# Altium project Project-C_VOLTAGE.PrjPCB (part 2 of 6)

## Sheet VoltageAmplifier_1xFPGA.SchDoc
size 635 x 241 mm
Used 4 times, as channels U_VoltageAmplifier_1xFPGA1, U_VoltageAmplifier_1xFPGA2, U_VoltageAmplifier_1xFPGA3, U_VoltageAmplifier_1xFPGA4. Parts and nets are listed once, with the designators drawn on the sheet.
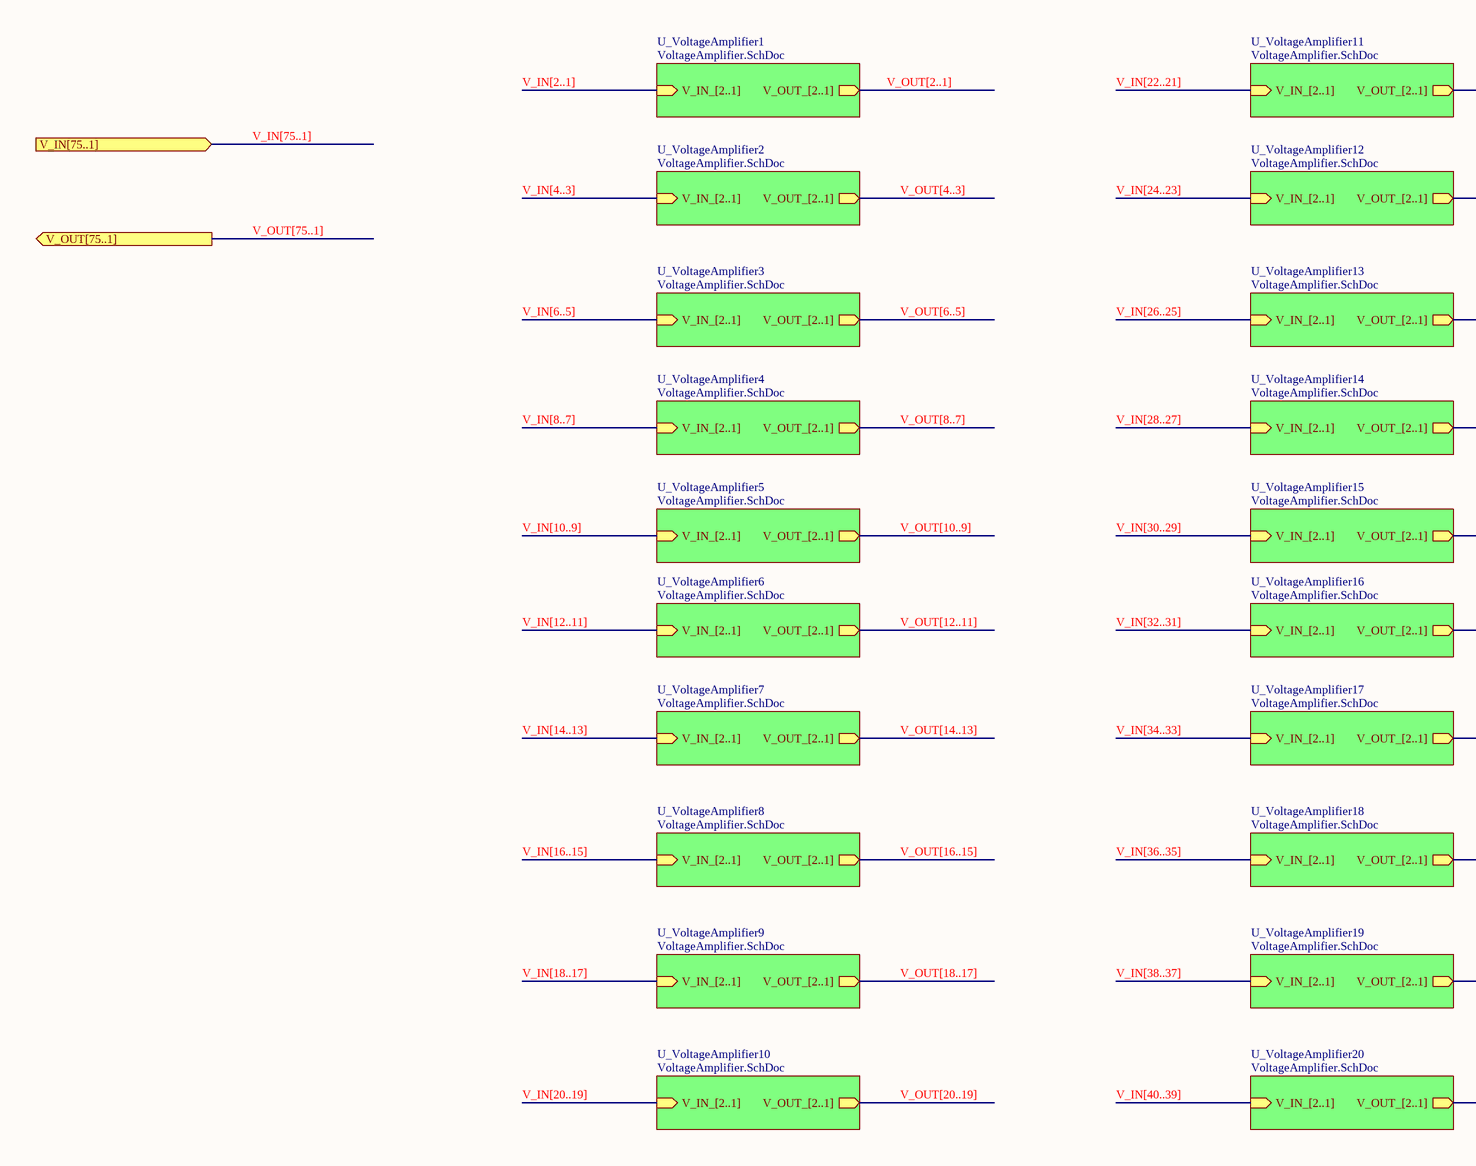
[diagram p7: VoltageAmplifier_1xFPGA.SchDoc, left]
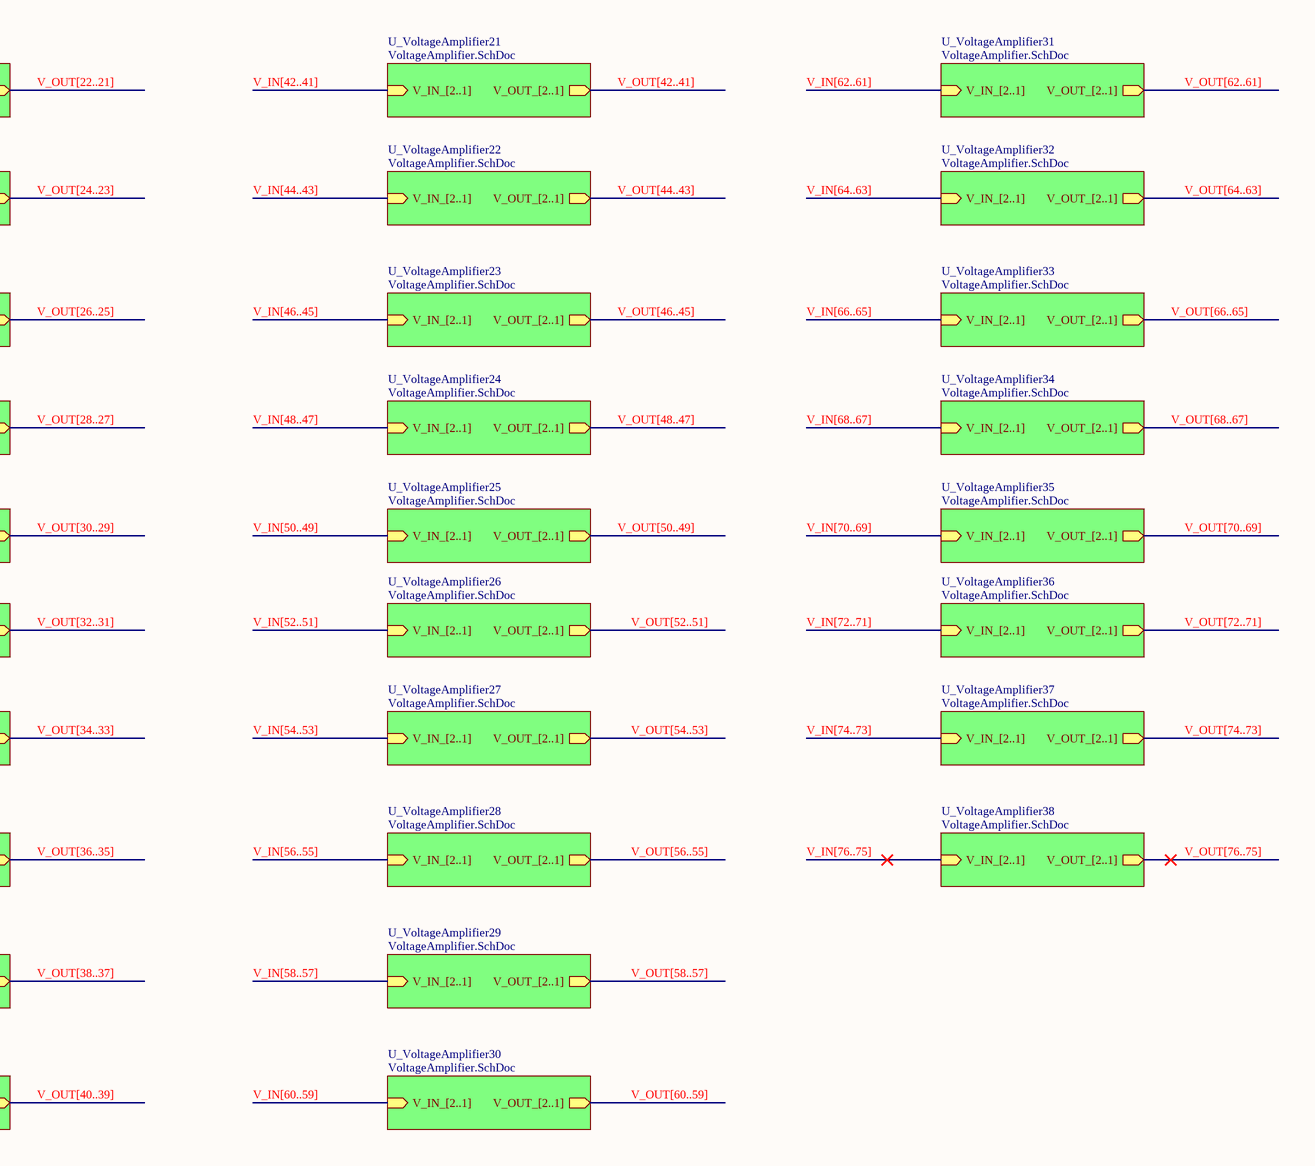
[diagram p8: VoltageAmplifier_1xFPGA.SchDoc, right]

### Sub-sheets
U_VoltageAmplifier1 = VoltageAmplifier.SchDoc: V_OUT_[2..1] (out), V_IN_[2..1] (in)
U_VoltageAmplifier2 = VoltageAmplifier.SchDoc: V_OUT_[2..1] (out), V_IN_[2..1] (in)
U_VoltageAmplifier3 = VoltageAmplifier.SchDoc: V_OUT_[2..1] (out), V_IN_[2..1] (in)
U_VoltageAmplifier4 = VoltageAmplifier.SchDoc: V_OUT_[2..1] (out), V_IN_[2..1] (in)
U_VoltageAmplifier5 = VoltageAmplifier.SchDoc: V_OUT_[2..1] (out), V_IN_[2..1] (in)
U_VoltageAmplifier6 = VoltageAmplifier.SchDoc: V_OUT_[2..1] (out), V_IN_[2..1] (in)
U_VoltageAmplifier7 = VoltageAmplifier.SchDoc: V_OUT_[2..1] (out), V_IN_[2..1] (in)
U_VoltageAmplifier8 = VoltageAmplifier.SchDoc: V_OUT_[2..1] (out), V_IN_[2..1] (in)
U_VoltageAmplifier9 = VoltageAmplifier.SchDoc: V_OUT_[2..1] (out), V_IN_[2..1] (in)
U_VoltageAmplifier10 = VoltageAmplifier.SchDoc: V_OUT_[2..1] (out), V_IN_[2..1] (in)
U_VoltageAmplifier11 = VoltageAmplifier.SchDoc: V_OUT_[2..1] (out), V_IN_[2..1] (in)
U_VoltageAmplifier12 = VoltageAmplifier.SchDoc: V_OUT_[2..1] (out), V_IN_[2..1] (in)
U_VoltageAmplifier13 = VoltageAmplifier.SchDoc: V_OUT_[2..1] (out), V_IN_[2..1] (in)
U_VoltageAmplifier14 = VoltageAmplifier.SchDoc: V_OUT_[2..1] (out), V_IN_[2..1] (in)
U_VoltageAmplifier15 = VoltageAmplifier.SchDoc: V_OUT_[2..1] (out), V_IN_[2..1] (in)
U_VoltageAmplifier16 = VoltageAmplifier.SchDoc: V_OUT_[2..1] (out), V_IN_[2..1] (in)
U_VoltageAmplifier17 = VoltageAmplifier.SchDoc: V_OUT_[2..1] (out), V_IN_[2..1] (in)
U_VoltageAmplifier18 = VoltageAmplifier.SchDoc: V_OUT_[2..1] (out), V_IN_[2..1] (in)
U_VoltageAmplifier19 = VoltageAmplifier.SchDoc: V_OUT_[2..1] (out), V_IN_[2..1] (in)
U_VoltageAmplifier20 = VoltageAmplifier.SchDoc: V_OUT_[2..1] (out), V_IN_[2..1] (in)
U_VoltageAmplifier21 = VoltageAmplifier.SchDoc: V_OUT_[2..1] (out), V_IN_[2..1] (in)
U_VoltageAmplifier22 = VoltageAmplifier.SchDoc: V_OUT_[2..1] (out), V_IN_[2..1] (in)
U_VoltageAmplifier23 = VoltageAmplifier.SchDoc: V_OUT_[2..1] (out), V_IN_[2..1] (in)
U_VoltageAmplifier24 = VoltageAmplifier.SchDoc: V_OUT_[2..1] (out), V_IN_[2..1] (in)
U_VoltageAmplifier25 = VoltageAmplifier.SchDoc: V_OUT_[2..1] (out), V_IN_[2..1] (in)
U_VoltageAmplifier26 = VoltageAmplifier.SchDoc: V_OUT_[2..1] (out), V_IN_[2..1] (in)
U_VoltageAmplifier27 = VoltageAmplifier.SchDoc: V_OUT_[2..1] (out), V_IN_[2..1] (in)
U_VoltageAmplifier28 = VoltageAmplifier.SchDoc: V_OUT_[2..1] (out), V_IN_[2..1] (in)
U_VoltageAmplifier29 = VoltageAmplifier.SchDoc: V_OUT_[2..1] (out), V_IN_[2..1] (in)
U_VoltageAmplifier30 = VoltageAmplifier.SchDoc: V_OUT_[2..1] (out), V_IN_[2..1] (in)
U_VoltageAmplifier31 = VoltageAmplifier.SchDoc: V_OUT_[2..1] (out), V_IN_[2..1] (in)
U_VoltageAmplifier32 = VoltageAmplifier.SchDoc: V_OUT_[2..1] (out), V_IN_[2..1] (in)
U_VoltageAmplifier33 = VoltageAmplifier.SchDoc: V_OUT_[2..1] (out), V_IN_[2..1] (in)
U_VoltageAmplifier34 = VoltageAmplifier.SchDoc: V_OUT_[2..1] (out), V_IN_[2..1] (in)
U_VoltageAmplifier35 = VoltageAmplifier.SchDoc: V_OUT_[2..1] (out), V_IN_[2..1] (in)
U_VoltageAmplifier36 = VoltageAmplifier.SchDoc: V_OUT_[2..1] (out), V_IN_[2..1] (in)
U_VoltageAmplifier37 = VoltageAmplifier.SchDoc: V_OUT_[2..1] (out), V_IN_[2..1] (in)
U_VoltageAmplifier38 = VoltageAmplifier.SchDoc: V_OUT_[2..1] (out), V_IN_[2..1] (in)

### Ports
V_IN[75..1] (in), V_OUT[75..1] (out)

### Channels
U_VoltageAmplifier_1xFPGA1: no parts or ports
U_VoltageAmplifier_1xFPGA2: no parts or ports
U_VoltageAmplifier_1xFPGA3: no parts or ports
U_VoltageAmplifier_1xFPGA4: no parts or ports

### Buses and harness runs
bus V_IN[2..1] = sheet U_VoltageAmplifier1/V_IN_[2..1]
bus V_IN[4..3] = sheet U_VoltageAmplifier2/V_IN_[2..1]
bus V_IN[6..5] = sheet U_VoltageAmplifier3/V_IN_[2..1]
bus V_IN[8..7] = sheet U_VoltageAmplifier4/V_IN_[2..1]
bus V_IN[10..9] = sheet U_VoltageAmplifier5/V_IN_[2..1]
bus V_IN[12..11] = sheet U_VoltageAmplifier6/V_IN_[2..1]
bus V_IN[14..13] = sheet U_VoltageAmplifier7/V_IN_[2..1]
bus V_IN[16..15] = sheet U_VoltageAmplifier8/V_IN_[2..1]
bus V_IN[18..17] = sheet U_VoltageAmplifier9/V_IN_[2..1]
bus V_IN[20..19] = sheet U_VoltageAmplifier10/V_IN_[2..1]
bus V_IN[22..21] = sheet U_VoltageAmplifier11/V_IN_[2..1]
bus V_IN[24..23] = sheet U_VoltageAmplifier12/V_IN_[2..1]
bus V_IN[26..25] = sheet U_VoltageAmplifier13/V_IN_[2..1]
bus V_IN[28..27] = sheet U_VoltageAmplifier14/V_IN_[2..1]
bus V_IN[30..29] = sheet U_VoltageAmplifier15/V_IN_[2..1]
bus V_IN[32..31] = sheet U_VoltageAmplifier16/V_IN_[2..1]
bus V_IN[34..33] = sheet U_VoltageAmplifier17/V_IN_[2..1]
bus V_IN[36..35] = sheet U_VoltageAmplifier18/V_IN_[2..1]
bus V_IN[38..37] = sheet U_VoltageAmplifier19/V_IN_[2..1]
bus V_IN[40..39] = sheet U_VoltageAmplifier20/V_IN_[2..1]
bus V_IN[42..41] = sheet U_VoltageAmplifier21/V_IN_[2..1]
bus V_IN[44..43] = sheet U_VoltageAmplifier22/V_IN_[2..1]
bus V_IN[46..45] = sheet U_VoltageAmplifier23/V_IN_[2..1]
bus V_IN[48..47] = sheet U_VoltageAmplifier24/V_IN_[2..1]
bus V_IN[50..49] = sheet U_VoltageAmplifier25/V_IN_[2..1]
bus V_IN[52..51] = sheet U_VoltageAmplifier26/V_IN_[2..1]
bus V_IN[54..53] = sheet U_VoltageAmplifier27/V_IN_[2..1]
bus V_IN[56..55] = sheet U_VoltageAmplifier28/V_IN_[2..1]
bus V_IN[58..57] = sheet U_VoltageAmplifier29/V_IN_[2..1]
bus V_IN[60..59] = sheet U_VoltageAmplifier30/V_IN_[2..1]
bus V_IN[62..61] = sheet U_VoltageAmplifier31/V_IN_[2..1]
bus V_IN[64..63] = sheet U_VoltageAmplifier32/V_IN_[2..1]
bus V_IN[66..65] = sheet U_VoltageAmplifier33/V_IN_[2..1]
bus V_IN[68..67] = sheet U_VoltageAmplifier34/V_IN_[2..1]
bus V_IN[70..69] = sheet U_VoltageAmplifier35/V_IN_[2..1]
bus V_IN[72..71] = sheet U_VoltageAmplifier36/V_IN_[2..1]
bus V_IN[74..73] = sheet U_VoltageAmplifier37/V_IN_[2..1]
bus V_IN[75..1] = port V_IN[75..1]
bus V_IN[76..75] = sheet U_VoltageAmplifier38/V_IN_[2..1]
bus V_OUT[2..1] = sheet U_VoltageAmplifier1/V_OUT_[2..1]
bus V_OUT[4..3] = sheet U_VoltageAmplifier2/V_OUT_[2..1]
bus V_OUT[6..5] = sheet U_VoltageAmplifier3/V_OUT_[2..1]
bus V_OUT[8..7] = sheet U_VoltageAmplifier4/V_OUT_[2..1]
bus V_OUT[10..9] = sheet U_VoltageAmplifier5/V_OUT_[2..1]
bus V_OUT[12..11] = sheet U_VoltageAmplifier6/V_OUT_[2..1]
bus V_OUT[14..13] = sheet U_VoltageAmplifier7/V_OUT_[2..1]
bus V_OUT[16..15] = sheet U_VoltageAmplifier8/V_OUT_[2..1]
bus V_OUT[18..17] = sheet U_VoltageAmplifier9/V_OUT_[2..1]
bus V_OUT[20..19] = sheet U_VoltageAmplifier10/V_OUT_[2..1]
bus V_OUT[22..21] = sheet U_VoltageAmplifier11/V_OUT_[2..1]
bus V_OUT[24..23] = sheet U_VoltageAmplifier12/V_OUT_[2..1]
bus V_OUT[26..25] = sheet U_VoltageAmplifier13/V_OUT_[2..1]
bus V_OUT[28..27] = sheet U_VoltageAmplifier14/V_OUT_[2..1]
bus V_OUT[30..29] = sheet U_VoltageAmplifier15/V_OUT_[2..1]
bus V_OUT[32..31] = sheet U_VoltageAmplifier16/V_OUT_[2..1]
bus V_OUT[34..33] = sheet U_VoltageAmplifier17/V_OUT_[2..1]
bus V_OUT[36..35] = sheet U_VoltageAmplifier18/V_OUT_[2..1]
bus V_OUT[38..37] = sheet U_VoltageAmplifier19/V_OUT_[2..1]
bus V_OUT[40..39] = sheet U_VoltageAmplifier20/V_OUT_[2..1]
bus V_OUT[42..41] = sheet U_VoltageAmplifier21/V_OUT_[2..1]
bus V_OUT[44..43] = sheet U_VoltageAmplifier22/V_OUT_[2..1]
bus V_OUT[46..45] = sheet U_VoltageAmplifier23/V_OUT_[2..1]
bus V_OUT[48..47] = sheet U_VoltageAmplifier24/V_OUT_[2..1]
bus V_OUT[50..49] = sheet U_VoltageAmplifier25/V_OUT_[2..1]
bus V_OUT[52..51] = sheet U_VoltageAmplifier26/V_OUT_[2..1]
bus V_OUT[54..53] = sheet U_VoltageAmplifier27/V_OUT_[2..1]
bus V_OUT[56..55] = sheet U_VoltageAmplifier28/V_OUT_[2..1]
bus V_OUT[58..57] = sheet U_VoltageAmplifier29/V_OUT_[2..1]
bus V_OUT[60..59] = sheet U_VoltageAmplifier30/V_OUT_[2..1]
bus V_OUT[62..61] = sheet U_VoltageAmplifier31/V_OUT_[2..1]
bus V_OUT[64..63] = sheet U_VoltageAmplifier32/V_OUT_[2..1]
bus V_OUT[66..65] = sheet U_VoltageAmplifier33/V_OUT_[2..1]
bus V_OUT[68..67] = sheet U_VoltageAmplifier34/V_OUT_[2..1]
bus V_OUT[70..69] = sheet U_VoltageAmplifier35/V_OUT_[2..1]
bus V_OUT[72..71] = sheet U_VoltageAmplifier36/V_OUT_[2..1]
bus V_OUT[74..73] = sheet U_VoltageAmplifier37/V_OUT_[2..1]
bus V_OUT[75..1] = port V_OUT[75..1]
bus V_OUT[76..75] = sheet U_VoltageAmplifier38/V_OUT_[2..1]

## Sheet VoltageAmplifier.SchDoc
size B
Used 152 times, as channels U_VoltageAmplifier_1xFPGA1/U_VoltageAmplifier1, U_VoltageAmplifier_1xFPGA1/U_VoltageAmplifier2, U_VoltageAmplifier_1xFPGA1/U_VoltageAmplifier3, U_VoltageAmplifier_1xFPGA1/U_VoltageAmplifier4, U_VoltageAmplifier_1xFPGA1/U_VoltageAmplifier5, U_VoltageAmplifier_1xFPGA1/U_VoltageAmplifier6, U_VoltageAmplifier_1xFPGA1/U_VoltageAmplifier7, U_VoltageAmplifier_1xFPGA1/U_VoltageAmplifier8, U_VoltageAmplifier_1xFPGA1/U_VoltageAmplifier9, U_VoltageAmplifier_1xFPGA1/U_VoltageAmplifier10, U_VoltageAmplifier_1xFPGA1/U_VoltageAmplifier11, U_VoltageAmplifier_1xFPGA1/U_VoltageAmplifier12, U_VoltageAmplifier_1xFPGA1/U_VoltageAmplifier13, U_VoltageAmplifier_1xFPGA1/U_VoltageAmplifier14, U_VoltageAmplifier_1xFPGA1/U_VoltageAmplifier15, U_VoltageAmplifier_1xFPGA1/U_VoltageAmplifier16, U_VoltageAmplifier_1xFPGA1/U_VoltageAmplifier17, U_VoltageAmplifier_1xFPGA1/U_VoltageAmplifier18, U_VoltageAmplifier_1xFPGA1/U_VoltageAmplifier19, U_VoltageAmplifier_1xFPGA1/U_VoltageAmplifier20, U_VoltageAmplifier_1xFPGA1/U_VoltageAmplifier21, U_VoltageAmplifier_1xFPGA1/U_VoltageAmplifier22, U_VoltageAmplifier_1xFPGA1/U_VoltageAmplifier23, U_VoltageAmplifier_1xFPGA1/U_VoltageAmplifier24, U_VoltageAmplifier_1xFPGA1/U_VoltageAmplifier25, U_VoltageAmplifier_1xFPGA1/U_VoltageAmplifier26, U_VoltageAmplifier_1xFPGA1/U_VoltageAmplifier27, U_VoltageAmplifier_1xFPGA1/U_VoltageAmplifier28, U_VoltageAmplifier_1xFPGA1/U_VoltageAmplifier29, U_VoltageAmplifier_1xFPGA1/U_VoltageAmplifier30, U_VoltageAmplifier_1xFPGA1/U_VoltageAmplifier31, U_VoltageAmplifier_1xFPGA1/U_VoltageAmplifier32, U_VoltageAmplifier_1xFPGA1/U_VoltageAmplifier33, U_VoltageAmplifier_1xFPGA1/U_VoltageAmplifier34, U_VoltageAmplifier_1xFPGA1/U_VoltageAmplifier35, U_VoltageAmplifier_1xFPGA1/U_VoltageAmplifier36, U_VoltageAmplifier_1xFPGA1/U_VoltageAmplifier37, U_VoltageAmplifier_1xFPGA1/U_VoltageAmplifier38, U_VoltageAmplifier_1xFPGA2/U_VoltageAmplifier1, U_VoltageAmplifier_1xFPGA2/U_VoltageAmplifier2, U_VoltageAmplifier_1xFPGA2/U_VoltageAmplifier3, U_VoltageAmplifier_1xFPGA2/U_VoltageAmplifier4, U_VoltageAmplifier_1xFPGA2/U_VoltageAmplifier5, U_VoltageAmplifier_1xFPGA2/U_VoltageAmplifier6, U_VoltageAmplifier_1xFPGA2/U_VoltageAmplifier7, U_VoltageAmplifier_1xFPGA2/U_VoltageAmplifier8, U_VoltageAmplifier_1xFPGA2/U_VoltageAmplifier9, U_VoltageAmplifier_1xFPGA2/U_VoltageAmplifier10, U_VoltageAmplifier_1xFPGA2/U_VoltageAmplifier11, U_VoltageAmplifier_1xFPGA2/U_VoltageAmplifier12, U_VoltageAmplifier_1xFPGA2/U_VoltageAmplifier13, U_VoltageAmplifier_1xFPGA2/U_VoltageAmplifier14, U_VoltageAmplifier_1xFPGA2/U_VoltageAmplifier15, U_VoltageAmplifier_1xFPGA2/U_VoltageAmplifier16, U_VoltageAmplifier_1xFPGA2/U_VoltageAmplifier17, U_VoltageAmplifier_1xFPGA2/U_VoltageAmplifier18, U_VoltageAmplifier_1xFPGA2/U_VoltageAmplifier19, U_VoltageAmplifier_1xFPGA2/U_VoltageAmplifier20, U_VoltageAmplifier_1xFPGA2/U_VoltageAmplifier21, U_VoltageAmplifier_1xFPGA2/U_VoltageAmplifier22, U_VoltageAmplifier_1xFPGA2/U_VoltageAmplifier23, U_VoltageAmplifier_1xFPGA2/U_VoltageAmplifier24, U_VoltageAmplifier_1xFPGA2/U_VoltageAmplifier25, U_VoltageAmplifier_1xFPGA2/U_VoltageAmplifier26, U_VoltageAmplifier_1xFPGA2/U_VoltageAmplifier27, U_VoltageAmplifier_1xFPGA2/U_VoltageAmplifier28, U_VoltageAmplifier_1xFPGA2/U_VoltageAmplifier29, U_VoltageAmplifier_1xFPGA2/U_VoltageAmplifier30, U_VoltageAmplifier_1xFPGA2/U_VoltageAmplifier31, U_VoltageAmplifier_1xFPGA2/U_VoltageAmplifier32, U_VoltageAmplifier_1xFPGA2/U_VoltageAmplifier33, U_VoltageAmplifier_1xFPGA2/U_VoltageAmplifier34, U_VoltageAmplifier_1xFPGA2/U_VoltageAmplifier35, U_VoltageAmplifier_1xFPGA2/U_VoltageAmplifier36, U_VoltageAmplifier_1xFPGA2/U_VoltageAmplifier37, U_VoltageAmplifier_1xFPGA2/U_VoltageAmplifier38, U_VoltageAmplifier_1xFPGA3/U_VoltageAmplifier1, U_VoltageAmplifier_1xFPGA3/U_VoltageAmplifier2, U_VoltageAmplifier_1xFPGA3/U_VoltageAmplifier3, U_VoltageAmplifier_1xFPGA3/U_VoltageAmplifier4, U_VoltageAmplifier_1xFPGA3/U_VoltageAmplifier5, U_VoltageAmplifier_1xFPGA3/U_VoltageAmplifier6, U_VoltageAmplifier_1xFPGA3/U_VoltageAmplifier7, U_VoltageAmplifier_1xFPGA3/U_VoltageAmplifier8, U_VoltageAmplifier_1xFPGA3/U_VoltageAmplifier9, U_VoltageAmplifier_1xFPGA3/U_VoltageAmplifier10, U_VoltageAmplifier_1xFPGA3/U_VoltageAmplifier11, U_VoltageAmplifier_1xFPGA3/U_VoltageAmplifier12, U_VoltageAmplifier_1xFPGA3/U_VoltageAmplifier13, U_VoltageAmplifier_1xFPGA3/U_VoltageAmplifier14, U_VoltageAmplifier_1xFPGA3/U_VoltageAmplifier15, U_VoltageAmplifier_1xFPGA3/U_VoltageAmplifier16, U_VoltageAmplifier_1xFPGA3/U_VoltageAmplifier17, U_VoltageAmplifier_1xFPGA3/U_VoltageAmplifier18, U_VoltageAmplifier_1xFPGA3/U_VoltageAmplifier19, U_VoltageAmplifier_1xFPGA3/U_VoltageAmplifier20, U_VoltageAmplifier_1xFPGA3/U_VoltageAmplifier21, U_VoltageAmplifier_1xFPGA3/U_VoltageAmplifier22, U_VoltageAmplifier_1xFPGA3/U_VoltageAmplifier23, U_VoltageAmplifier_1xFPGA3/U_VoltageAmplifier24, U_VoltageAmplifier_1xFPGA3/U_VoltageAmplifier25, U_VoltageAmplifier_1xFPGA3/U_VoltageAmplifier26, U_VoltageAmplifier_1xFPGA3/U_VoltageAmplifier27, U_VoltageAmplifier_1xFPGA3/U_VoltageAmplifier28, U_VoltageAmplifier_1xFPGA3/U_VoltageAmplifier29, U_VoltageAmplifier_1xFPGA3/U_VoltageAmplifier30, U_VoltageAmplifier_1xFPGA3/U_VoltageAmplifier31, U_VoltageAmplifier_1xFPGA3/U_VoltageAmplifier32, U_VoltageAmplifier_1xFPGA3/U_VoltageAmplifier33, U_VoltageAmplifier_1xFPGA3/U_VoltageAmplifier34, U_VoltageAmplifier_1xFPGA3/U_VoltageAmplifier35, U_VoltageAmplifier_1xFPGA3/U_VoltageAmplifier36, U_VoltageAmplifier_1xFPGA3/U_VoltageAmplifier37, U_VoltageAmplifier_1xFPGA3/U_VoltageAmplifier38, U_VoltageAmplifier_1xFPGA4/U_VoltageAmplifier1, U_VoltageAmplifier_1xFPGA4/U_VoltageAmplifier2, U_VoltageAmplifier_1xFPGA4/U_VoltageAmplifier3, U_VoltageAmplifier_1xFPGA4/U_VoltageAmplifier4, U_VoltageAmplifier_1xFPGA4/U_VoltageAmplifier5, U_VoltageAmplifier_1xFPGA4/U_VoltageAmplifier6, U_VoltageAmplifier_1xFPGA4/U_VoltageAmplifier7, U_VoltageAmplifier_1xFPGA4/U_VoltageAmplifier8, U_VoltageAmplifier_1xFPGA4/U_VoltageAmplifier9, U_VoltageAmplifier_1xFPGA4/U_VoltageAmplifier10, U_VoltageAmplifier_1xFPGA4/U_VoltageAmplifier11, U_VoltageAmplifier_1xFPGA4/U_VoltageAmplifier12, U_VoltageAmplifier_1xFPGA4/U_VoltageAmplifier13, U_VoltageAmplifier_1xFPGA4/U_VoltageAmplifier14, U_VoltageAmplifier_1xFPGA4/U_VoltageAmplifier15, U_VoltageAmplifier_1xFPGA4/U_VoltageAmplifier16, U_VoltageAmplifier_1xFPGA4/U_VoltageAmplifier17, U_VoltageAmplifier_1xFPGA4/U_VoltageAmplifier18, U_VoltageAmplifier_1xFPGA4/U_VoltageAmplifier19, U_VoltageAmplifier_1xFPGA4/U_VoltageAmplifier20, U_VoltageAmplifier_1xFPGA4/U_VoltageAmplifier21, U_VoltageAmplifier_1xFPGA4/U_VoltageAmplifier22, U_VoltageAmplifier_1xFPGA4/U_VoltageAmplifier23, U_VoltageAmplifier_1xFPGA4/U_VoltageAmplifier24, U_VoltageAmplifier_1xFPGA4/U_VoltageAmplifier25, U_VoltageAmplifier_1xFPGA4/U_VoltageAmplifier26, U_VoltageAmplifier_1xFPGA4/U_VoltageAmplifier27, U_VoltageAmplifier_1xFPGA4/U_VoltageAmplifier28, U_VoltageAmplifier_1xFPGA4/U_VoltageAmplifier29, U_VoltageAmplifier_1xFPGA4/U_VoltageAmplifier30, U_VoltageAmplifier_1xFPGA4/U_VoltageAmplifier31, U_VoltageAmplifier_1xFPGA4/U_VoltageAmplifier32, U_VoltageAmplifier_1xFPGA4/U_VoltageAmplifier33, U_VoltageAmplifier_1xFPGA4/U_VoltageAmplifier34, U_VoltageAmplifier_1xFPGA4/U_VoltageAmplifier35, U_VoltageAmplifier_1xFPGA4/U_VoltageAmplifier36, U_VoltageAmplifier_1xFPGA4/U_VoltageAmplifier37, U_VoltageAmplifier_1xFPGA4/U_VoltageAmplifier38. Parts and nets are listed once, with the designators drawn on the sheet.
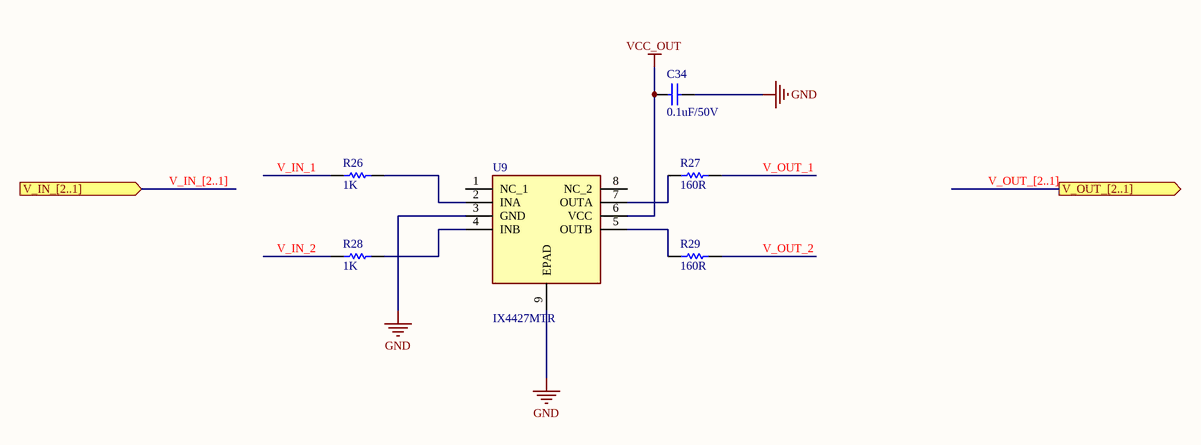
[diagram p9: VoltageAmplifier.SchDoc]

### Parts
C34  0.1uF/50V  [0603C]
R26  1K  [0603R]
R27  160R  [0603R]
R28  1K  [0603R]
R29  160R  [0603R]
U9  IX4427MTR  [IX4427MTR]

### Ports
V_IN_[2..1] (in), V_OUT_[2..1] (out)

### Nets
GND: C34.2 U9.3(GND) U9.9(EPAD)
VCC_OUT: C34.1 U9.6(VCC)
V_IN_1: R26.1
V_IN_2: R28.1
V_OUT_1: R27.2
V_OUT_2: R29.2
NetR26_2: R26.2 U9.2(INA)
NetR27_1: R27.1 U9.7(OUTA)
NetR28_2: R28.2 U9.4(INB)
NetR29_1: R29.1 U9.5(OUTB)

Not connected (* = marked no-connect by the designer): U9 1(NC_1) 8(NC_2)

### Channels
U_VoltageAmplifier_1xFPGA1/U_VoltageAmplifier1: designators end in _U_VoltageAmplifier_1xFPGA1_U_VoltageAmplifier1
U_VoltageAmplifier_1xFPGA1/U_VoltageAmplifier2: designators end in _U_VoltageAmplifier_1xFPGA1_U_VoltageAmplifier2
U_VoltageAmplifier_1xFPGA1/U_VoltageAmplifier3: designators end in _U_VoltageAmplifier_1xFPGA1_U_VoltageAmplifier3
U_VoltageAmplifier_1xFPGA1/U_VoltageAmplifier4: designators end in _U_VoltageAmplifier_1xFPGA1_U_VoltageAmplifier4
U_VoltageAmplifier_1xFPGA1/U_VoltageAmplifier5: designators end in _U_VoltageAmplifier_1xFPGA1_U_VoltageAmplifier5
U_VoltageAmplifier_1xFPGA1/U_VoltageAmplifier6: designators end in _U_VoltageAmplifier_1xFPGA1_U_VoltageAmplifier6
U_VoltageAmplifier_1xFPGA1/U_VoltageAmplifier7: designators end in _U_VoltageAmplifier_1xFPGA1_U_VoltageAmplifier7
U_VoltageAmplifier_1xFPGA1/U_VoltageAmplifier8: designators end in _U_VoltageAmplifier_1xFPGA1_U_VoltageAmplifier8
U_VoltageAmplifier_1xFPGA1/U_VoltageAmplifier9: designators end in _U_VoltageAmplifier_1xFPGA1_U_VoltageAmplifier9
U_VoltageAmplifier_1xFPGA1/U_VoltageAmplifier10: designators end in _U_VoltageAmplifier_1xFPGA1_U_VoltageAmplifier10
U_VoltageAmplifier_1xFPGA1/U_VoltageAmplifier11: designators end in _U_VoltageAmplifier_1xFPGA1_U_VoltageAmplifier11
U_VoltageAmplifier_1xFPGA1/U_VoltageAmplifier12: designators end in _U_VoltageAmplifier_1xFPGA1_U_VoltageAmplifier12
U_VoltageAmplifier_1xFPGA1/U_VoltageAmplifier13: designators end in _U_VoltageAmplifier_1xFPGA1_U_VoltageAmplifier13
U_VoltageAmplifier_1xFPGA1/U_VoltageAmplifier14: designators end in _U_VoltageAmplifier_1xFPGA1_U_VoltageAmplifier14
U_VoltageAmplifier_1xFPGA1/U_VoltageAmplifier15: designators end in _U_VoltageAmplifier_1xFPGA1_U_VoltageAmplifier15
U_VoltageAmplifier_1xFPGA1/U_VoltageAmplifier16: designators end in _U_VoltageAmplifier_1xFPGA1_U_VoltageAmplifier16
U_VoltageAmplifier_1xFPGA1/U_VoltageAmplifier17: designators end in _U_VoltageAmplifier_1xFPGA1_U_VoltageAmplifier17
U_VoltageAmplifier_1xFPGA1/U_VoltageAmplifier18: designators end in _U_VoltageAmplifier_1xFPGA1_U_VoltageAmplifier18
U_VoltageAmplifier_1xFPGA1/U_VoltageAmplifier19: designators end in _U_VoltageAmplifier_1xFPGA1_U_VoltageAmplifier19
U_VoltageAmplifier_1xFPGA1/U_VoltageAmplifier20: designators end in _U_VoltageAmplifier_1xFPGA1_U_VoltageAmplifier20
U_VoltageAmplifier_1xFPGA1/U_VoltageAmplifier21: designators end in _U_VoltageAmplifier_1xFPGA1_U_VoltageAmplifier21
U_VoltageAmplifier_1xFPGA1/U_VoltageAmplifier22: designators end in _U_VoltageAmplifier_1xFPGA1_U_VoltageAmplifier22
U_VoltageAmplifier_1xFPGA1/U_VoltageAmplifier23: designators end in _U_VoltageAmplifier_1xFPGA1_U_VoltageAmplifier23
U_VoltageAmplifier_1xFPGA1/U_VoltageAmplifier24: designators end in _U_VoltageAmplifier_1xFPGA1_U_VoltageAmplifier24
U_VoltageAmplifier_1xFPGA1/U_VoltageAmplifier25: designators end in _U_VoltageAmplifier_1xFPGA1_U_VoltageAmplifier25
U_VoltageAmplifier_1xFPGA1/U_VoltageAmplifier26: designators end in _U_VoltageAmplifier_1xFPGA1_U_VoltageAmplifier26
U_VoltageAmplifier_1xFPGA1/U_VoltageAmplifier27: designators end in _U_VoltageAmplifier_1xFPGA1_U_VoltageAmplifier27
U_VoltageAmplifier_1xFPGA1/U_VoltageAmplifier28: designators end in _U_VoltageAmplifier_1xFPGA1_U_VoltageAmplifier28
U_VoltageAmplifier_1xFPGA1/U_VoltageAmplifier29: designators end in _U_VoltageAmplifier_1xFPGA1_U_VoltageAmplifier29
U_VoltageAmplifier_1xFPGA1/U_VoltageAmplifier30: designators end in _U_VoltageAmplifier_1xFPGA1_U_VoltageAmplifier30
U_VoltageAmplifier_1xFPGA1/U_VoltageAmplifier31: designators end in _U_VoltageAmplifier_1xFPGA1_U_VoltageAmplifier31
U_VoltageAmplifier_1xFPGA1/U_VoltageAmplifier32: designators end in _U_VoltageAmplifier_1xFPGA1_U_VoltageAmplifier32
U_VoltageAmplifier_1xFPGA1/U_VoltageAmplifier33: designators end in _U_VoltageAmplifier_1xFPGA1_U_VoltageAmplifier33
U_VoltageAmplifier_1xFPGA1/U_VoltageAmplifier34: designators end in _U_VoltageAmplifier_1xFPGA1_U_VoltageAmplifier34
U_VoltageAmplifier_1xFPGA1/U_VoltageAmplifier35: designators end in _U_VoltageAmplifier_1xFPGA1_U_VoltageAmplifier35
U_VoltageAmplifier_1xFPGA1/U_VoltageAmplifier36: designators end in _U_VoltageAmplifier_1xFPGA1_U_VoltageAmplifier36
U_VoltageAmplifier_1xFPGA1/U_VoltageAmplifier37: designators end in _U_VoltageAmplifier_1xFPGA1_U_VoltageAmplifier37
U_VoltageAmplifier_1xFPGA1/U_VoltageAmplifier38: designators end in _U_VoltageAmplifier_1xFPGA1_U_VoltageAmplifier38
U_VoltageAmplifier_1xFPGA2/U_VoltageAmplifier1: designators end in _U_VoltageAmplifier_1xFPGA2_U_VoltageAmplifier1
U_VoltageAmplifier_1xFPGA2/U_VoltageAmplifier2: designators end in _U_VoltageAmplifier_1xFPGA2_U_VoltageAmplifier2
U_VoltageAmplifier_1xFPGA2/U_VoltageAmplifier3: designators end in _U_VoltageAmplifier_1xFPGA2_U_VoltageAmplifier3
U_VoltageAmplifier_1xFPGA2/U_VoltageAmplifier4: designators end in _U_VoltageAmplifier_1xFPGA2_U_VoltageAmplifier4
U_VoltageAmplifier_1xFPGA2/U_VoltageAmplifier5: designators end in _U_VoltageAmplifier_1xFPGA2_U_VoltageAmplifier5
U_VoltageAmplifier_1xFPGA2/U_VoltageAmplifier6: designators end in _U_VoltageAmplifier_1xFPGA2_U_VoltageAmplifier6
U_VoltageAmplifier_1xFPGA2/U_VoltageAmplifier7: designators end in _U_VoltageAmplifier_1xFPGA2_U_VoltageAmplifier7
U_VoltageAmplifier_1xFPGA2/U_VoltageAmplifier8: designators end in _U_VoltageAmplifier_1xFPGA2_U_VoltageAmplifier8
U_VoltageAmplifier_1xFPGA2/U_VoltageAmplifier9: designators end in _U_VoltageAmplifier_1xFPGA2_U_VoltageAmplifier9
U_VoltageAmplifier_1xFPGA2/U_VoltageAmplifier10: designators end in _U_VoltageAmplifier_1xFPGA2_U_VoltageAmplifier10
U_VoltageAmplifier_1xFPGA2/U_VoltageAmplifier11: designators end in _U_VoltageAmplifier_1xFPGA2_U_VoltageAmplifier11
U_VoltageAmplifier_1xFPGA2/U_VoltageAmplifier12: designators end in _U_VoltageAmplifier_1xFPGA2_U_VoltageAmplifier12
U_VoltageAmplifier_1xFPGA2/U_VoltageAmplifier13: designators end in _U_VoltageAmplifier_1xFPGA2_U_VoltageAmplifier13
U_VoltageAmplifier_1xFPGA2/U_VoltageAmplifier14: designators end in _U_VoltageAmplifier_1xFPGA2_U_VoltageAmplifier14
U_VoltageAmplifier_1xFPGA2/U_VoltageAmplifier15: designators end in _U_VoltageAmplifier_1xFPGA2_U_VoltageAmplifier15
U_VoltageAmplifier_1xFPGA2/U_VoltageAmplifier16: designators end in _U_VoltageAmplifier_1xFPGA2_U_VoltageAmplifier16
U_VoltageAmplifier_1xFPGA2/U_VoltageAmplifier17: designators end in _U_VoltageAmplifier_1xFPGA2_U_VoltageAmplifier17
U_VoltageAmplifier_1xFPGA2/U_VoltageAmplifier18: designators end in _U_VoltageAmplifier_1xFPGA2_U_VoltageAmplifier18
U_VoltageAmplifier_1xFPGA2/U_VoltageAmplifier19: designators end in _U_VoltageAmplifier_1xFPGA2_U_VoltageAmplifier19
U_VoltageAmplifier_1xFPGA2/U_VoltageAmplifier20: designators end in _U_VoltageAmplifier_1xFPGA2_U_VoltageAmplifier20
U_VoltageAmplifier_1xFPGA2/U_VoltageAmplifier21: designators end in _U_VoltageAmplifier_1xFPGA2_U_VoltageAmplifier21
U_VoltageAmplifier_1xFPGA2/U_VoltageAmplifier22: designators end in _U_VoltageAmplifier_1xFPGA2_U_VoltageAmplifier22
U_VoltageAmplifier_1xFPGA2/U_VoltageAmplifier23: designators end in _U_VoltageAmplifier_1xFPGA2_U_VoltageAmplifier23
U_VoltageAmplifier_1xFPGA2/U_VoltageAmplifier24: designators end in _U_VoltageAmplifier_1xFPGA2_U_VoltageAmplifier24
U_VoltageAmplifier_1xFPGA2/U_VoltageAmplifier25: designators end in _U_VoltageAmplifier_1xFPGA2_U_VoltageAmplifier25
U_VoltageAmplifier_1xFPGA2/U_VoltageAmplifier26: designators end in _U_VoltageAmplifier_1xFPGA2_U_VoltageAmplifier26
U_VoltageAmplifier_1xFPGA2/U_VoltageAmplifier27: designators end in _U_VoltageAmplifier_1xFPGA2_U_VoltageAmplifier27
U_VoltageAmplifier_1xFPGA2/U_VoltageAmplifier28: designators end in _U_VoltageAmplifier_1xFPGA2_U_VoltageAmplifier28
U_VoltageAmplifier_1xFPGA2/U_VoltageAmplifier29: designators end in _U_VoltageAmplifier_1xFPGA2_U_VoltageAmplifier29
U_VoltageAmplifier_1xFPGA2/U_VoltageAmplifier30: designators end in _U_VoltageAmplifier_1xFPGA2_U_VoltageAmplifier30
U_VoltageAmplifier_1xFPGA2/U_VoltageAmplifier31: designators end in _U_VoltageAmplifier_1xFPGA2_U_VoltageAmplifier31
U_VoltageAmplifier_1xFPGA2/U_VoltageAmplifier32: designators end in _U_VoltageAmplifier_1xFPGA2_U_VoltageAmplifier32
U_VoltageAmplifier_1xFPGA2/U_VoltageAmplifier33: designators end in _U_VoltageAmplifier_1xFPGA2_U_VoltageAmplifier33
U_VoltageAmplifier_1xFPGA2/U_VoltageAmplifier34: designators end in _U_VoltageAmplifier_1xFPGA2_U_VoltageAmplifier34
U_VoltageAmplifier_1xFPGA2/U_VoltageAmplifier35: designators end in _U_VoltageAmplifier_1xFPGA2_U_VoltageAmplifier35
U_VoltageAmplifier_1xFPGA2/U_VoltageAmplifier36: designators end in _U_VoltageAmplifier_1xFPGA2_U_VoltageAmplifier36
U_VoltageAmplifier_1xFPGA2/U_VoltageAmplifier37: designators end in _U_VoltageAmplifier_1xFPGA2_U_VoltageAmplifier37
U_VoltageAmplifier_1xFPGA2/U_VoltageAmplifier38: designators end in _U_VoltageAmplifier_1xFPGA2_U_VoltageAmplifier38
U_VoltageAmplifier_1xFPGA3/U_VoltageAmplifier1: designators end in _U_VoltageAmplifier_1xFPGA3_U_VoltageAmplifier1
U_VoltageAmplifier_1xFPGA3/U_VoltageAmplifier2: designators end in _U_VoltageAmplifier_1xFPGA3_U_VoltageAmplifier2
U_VoltageAmplifier_1xFPGA3/U_VoltageAmplifier3: designators end in _U_VoltageAmplifier_1xFPGA3_U_VoltageAmplifier3
U_VoltageAmplifier_1xFPGA3/U_VoltageAmplifier4: designators end in _U_VoltageAmplifier_1xFPGA3_U_VoltageAmplifier4
U_VoltageAmplifier_1xFPGA3/U_VoltageAmplifier5: designators end in _U_VoltageAmplifier_1xFPGA3_U_VoltageAmplifier5
U_VoltageAmplifier_1xFPGA3/U_VoltageAmplifier6: designators end in _U_VoltageAmplifier_1xFPGA3_U_VoltageAmplifier6
U_VoltageAmplifier_1xFPGA3/U_VoltageAmplifier7: designators end in _U_VoltageAmplifier_1xFPGA3_U_VoltageAmplifier7
U_VoltageAmplifier_1xFPGA3/U_VoltageAmplifier8: designators end in _U_VoltageAmplifier_1xFPGA3_U_VoltageAmplifier8
U_VoltageAmplifier_1xFPGA3/U_VoltageAmplifier9: designators end in _U_VoltageAmplifier_1xFPGA3_U_VoltageAmplifier9
U_VoltageAmplifier_1xFPGA3/U_VoltageAmplifier10: designators end in _U_VoltageAmplifier_1xFPGA3_U_VoltageAmplifier10
U_VoltageAmplifier_1xFPGA3/U_VoltageAmplifier11: designators end in _U_VoltageAmplifier_1xFPGA3_U_VoltageAmplifier11
U_VoltageAmplifier_1xFPGA3/U_VoltageAmplifier12: designators end in _U_VoltageAmplifier_1xFPGA3_U_VoltageAmplifier12
U_VoltageAmplifier_1xFPGA3/U_VoltageAmplifier13: designators end in _U_VoltageAmplifier_1xFPGA3_U_VoltageAmplifier13
U_VoltageAmplifier_1xFPGA3/U_VoltageAmplifier14: designators end in _U_VoltageAmplifier_1xFPGA3_U_VoltageAmplifier14
U_VoltageAmplifier_1xFPGA3/U_VoltageAmplifier15: designators end in _U_VoltageAmplifier_1xFPGA3_U_VoltageAmplifier15
U_VoltageAmplifier_1xFPGA3/U_VoltageAmplifier16: designators end in _U_VoltageAmplifier_1xFPGA3_U_VoltageAmplifier16
U_VoltageAmplifier_1xFPGA3/U_VoltageAmplifier17: designators end in _U_VoltageAmplifier_1xFPGA3_U_VoltageAmplifier17
U_VoltageAmplifier_1xFPGA3/U_VoltageAmplifier18: designators end in _U_VoltageAmplifier_1xFPGA3_U_VoltageAmplifier18
U_VoltageAmplifier_1xFPGA3/U_VoltageAmplifier19: designators end in _U_VoltageAmplifier_1xFPGA3_U_VoltageAmplifier19
U_VoltageAmplifier_1xFPGA3/U_VoltageAmplifier20: designators end in _U_VoltageAmplifier_1xFPGA3_U_VoltageAmplifier20
U_VoltageAmplifier_1xFPGA3/U_VoltageAmplifier21: designators end in _U_VoltageAmplifier_1xFPGA3_U_VoltageAmplifier21
U_VoltageAmplifier_1xFPGA3/U_VoltageAmplifier22: designators end in _U_VoltageAmplifier_1xFPGA3_U_VoltageAmplifier22
U_VoltageAmplifier_1xFPGA3/U_VoltageAmplifier23: designators end in _U_VoltageAmplifier_1xFPGA3_U_VoltageAmplifier23
U_VoltageAmplifier_1xFPGA3/U_VoltageAmplifier24: designators end in _U_VoltageAmplifier_1xFPGA3_U_VoltageAmplifier24
U_VoltageAmplifier_1xFPGA3/U_VoltageAmplifier25: designators end in _U_VoltageAmplifier_1xFPGA3_U_VoltageAmplifier25
U_VoltageAmplifier_1xFPGA3/U_VoltageAmplifier26: designators end in _U_VoltageAmplifier_1xFPGA3_U_VoltageAmplifier26
U_VoltageAmplifier_1xFPGA3/U_VoltageAmplifier27: designators end in _U_VoltageAmplifier_1xFPGA3_U_VoltageAmplifier27
U_VoltageAmplifier_1xFPGA3/U_VoltageAmplifier28: designators end in _U_VoltageAmplifier_1xFPGA3_U_VoltageAmplifier28
U_VoltageAmplifier_1xFPGA3/U_VoltageAmplifier29: designators end in _U_VoltageAmplifier_1xFPGA3_U_VoltageAmplifier29
U_VoltageAmplifier_1xFPGA3/U_VoltageAmplifier30: designators end in _U_VoltageAmplifier_1xFPGA3_U_VoltageAmplifier30
U_VoltageAmplifier_1xFPGA3/U_VoltageAmplifier31: designators end in _U_VoltageAmplifier_1xFPGA3_U_VoltageAmplifier31
U_VoltageAmplifier_1xFPGA3/U_VoltageAmplifier32: designators end in _U_VoltageAmplifier_1xFPGA3_U_VoltageAmplifier32
U_VoltageAmplifier_1xFPGA3/U_VoltageAmplifier33: designators end in _U_VoltageAmplifier_1xFPGA3_U_VoltageAmplifier33
U_VoltageAmplifier_1xFPGA3/U_VoltageAmplifier34: designators end in _U_VoltageAmplifier_1xFPGA3_U_VoltageAmplifier34
U_VoltageAmplifier_1xFPGA3/U_VoltageAmplifier35: designators end in _U_VoltageAmplifier_1xFPGA3_U_VoltageAmplifier35
U_VoltageAmplifier_1xFPGA3/U_VoltageAmplifier36: designators end in _U_VoltageAmplifier_1xFPGA3_U_VoltageAmplifier36
U_VoltageAmplifier_1xFPGA3/U_VoltageAmplifier37: designators end in _U_VoltageAmplifier_1xFPGA3_U_VoltageAmplifier37
U_VoltageAmplifier_1xFPGA3/U_VoltageAmplifier38: designators end in _U_VoltageAmplifier_1xFPGA3_U_VoltageAmplifier38
U_VoltageAmplifier_1xFPGA4/U_VoltageAmplifier1: designators end in _U_VoltageAmplifier_1xFPGA4_U_VoltageAmplifier1
U_VoltageAmplifier_1xFPGA4/U_VoltageAmplifier2: designators end in _U_VoltageAmplifier_1xFPGA4_U_VoltageAmplifier2
U_VoltageAmplifier_1xFPGA4/U_VoltageAmplifier3: designators end in _U_VoltageAmplifier_1xFPGA4_U_VoltageAmplifier3
U_VoltageAmplifier_1xFPGA4/U_VoltageAmplifier4: designators end in _U_VoltageAmplifier_1xFPGA4_U_VoltageAmplifier4
U_VoltageAmplifier_1xFPGA4/U_VoltageAmplifier5: designators end in _U_VoltageAmplifier_1xFPGA4_U_VoltageAmplifier5
U_VoltageAmplifier_1xFPGA4/U_VoltageAmplifier6: designators end in _U_VoltageAmplifier_1xFPGA4_U_VoltageAmplifier6
U_VoltageAmplifier_1xFPGA4/U_VoltageAmplifier7: designators end in _U_VoltageAmplifier_1xFPGA4_U_VoltageAmplifier7
U_VoltageAmplifier_1xFPGA4/U_VoltageAmplifier8: designators end in _U_VoltageAmplifier_1xFPGA4_U_VoltageAmplifier8
U_VoltageAmplifier_1xFPGA4/U_VoltageAmplifier9: designators end in _U_VoltageAmplifier_1xFPGA4_U_VoltageAmplifier9
U_VoltageAmplifier_1xFPGA4/U_VoltageAmplifier10: designators end in _U_VoltageAmplifier_1xFPGA4_U_VoltageAmplifier10
U_VoltageAmplifier_1xFPGA4/U_VoltageAmplifier11: designators end in _U_VoltageAmplifier_1xFPGA4_U_VoltageAmplifier11
U_VoltageAmplifier_1xFPGA4/U_VoltageAmplifier12: designators end in _U_VoltageAmplifier_1xFPGA4_U_VoltageAmplifier12
U_VoltageAmplifier_1xFPGA4/U_VoltageAmplifier13: designators end in _U_VoltageAmplifier_1xFPGA4_U_VoltageAmplifier13
U_VoltageAmplifier_1xFPGA4/U_VoltageAmplifier14: designators end in _U_VoltageAmplifier_1xFPGA4_U_VoltageAmplifier14
U_VoltageAmplifier_1xFPGA4/U_VoltageAmplifier15: designators end in _U_VoltageAmplifier_1xFPGA4_U_VoltageAmplifier15
U_VoltageAmplifier_1xFPGA4/U_VoltageAmplifier16: designators end in _U_VoltageAmplifier_1xFPGA4_U_VoltageAmplifier16
U_VoltageAmplifier_1xFPGA4/U_VoltageAmplifier17: designators end in _U_VoltageAmplifier_1xFPGA4_U_VoltageAmplifier17
U_VoltageAmplifier_1xFPGA4/U_VoltageAmplifier18: designators end in _U_VoltageAmplifier_1xFPGA4_U_VoltageAmplifier18
U_VoltageAmplifier_1xFPGA4/U_VoltageAmplifier19: designators end in _U_VoltageAmplifier_1xFPGA4_U_VoltageAmplifier19
U_VoltageAmplifier_1xFPGA4/U_VoltageAmplifier20: designators end in _U_VoltageAmplifier_1xFPGA4_U_VoltageAmplifier20
U_VoltageAmplifier_1xFPGA4/U_VoltageAmplifier21: designators end in _U_VoltageAmplifier_1xFPGA4_U_VoltageAmplifier21
U_VoltageAmplifier_1xFPGA4/U_VoltageAmplifier22: designators end in _U_VoltageAmplifier_1xFPGA4_U_VoltageAmplifier22
U_VoltageAmplifier_1xFPGA4/U_VoltageAmplifier23: designators end in _U_VoltageAmplifier_1xFPGA4_U_VoltageAmplifier23
U_VoltageAmplifier_1xFPGA4/U_VoltageAmplifier24: designators end in _U_VoltageAmplifier_1xFPGA4_U_VoltageAmplifier24
U_VoltageAmplifier_1xFPGA4/U_VoltageAmplifier25: designators end in _U_VoltageAmplifier_1xFPGA4_U_VoltageAmplifier25
U_VoltageAmplifier_1xFPGA4/U_VoltageAmplifier26: designators end in _U_VoltageAmplifier_1xFPGA4_U_VoltageAmplifier26
U_VoltageAmplifier_1xFPGA4/U_VoltageAmplifier27: designators end in _U_VoltageAmplifier_1xFPGA4_U_VoltageAmplifier27
U_VoltageAmplifier_1xFPGA4/U_VoltageAmplifier28: designators end in _U_VoltageAmplifier_1xFPGA4_U_VoltageAmplifier28
U_VoltageAmplifier_1xFPGA4/U_VoltageAmplifier29: designators end in _U_VoltageAmplifier_1xFPGA4_U_VoltageAmplifier29
U_VoltageAmplifier_1xFPGA4/U_VoltageAmplifier30: designators end in _U_VoltageAmplifier_1xFPGA4_U_VoltageAmplifier30
U_VoltageAmplifier_1xFPGA4/U_VoltageAmplifier31: designators end in _U_VoltageAmplifier_1xFPGA4_U_VoltageAmplifier31
U_VoltageAmplifier_1xFPGA4/U_VoltageAmplifier32: designators end in _U_VoltageAmplifier_1xFPGA4_U_VoltageAmplifier32
U_VoltageAmplifier_1xFPGA4/U_VoltageAmplifier33: designators end in _U_VoltageAmplifier_1xFPGA4_U_VoltageAmplifier33
U_VoltageAmplifier_1xFPGA4/U_VoltageAmplifier34: designators end in _U_VoltageAmplifier_1xFPGA4_U_VoltageAmplifier34
U_VoltageAmplifier_1xFPGA4/U_VoltageAmplifier35: designators end in _U_VoltageAmplifier_1xFPGA4_U_VoltageAmplifier35
U_VoltageAmplifier_1xFPGA4/U_VoltageAmplifier36: designators end in _U_VoltageAmplifier_1xFPGA4_U_VoltageAmplifier36
U_VoltageAmplifier_1xFPGA4/U_VoltageAmplifier37: designators end in _U_VoltageAmplifier_1xFPGA4_U_VoltageAmplifier37
U_VoltageAmplifier_1xFPGA4/U_VoltageAmplifier38: designators end in _U_VoltageAmplifier_1xFPGA4_U_VoltageAmplifier38

### Buses and harness runs
bus V_IN_[2..1] = port V_IN_[2..1]
bus V_OUT_[2..1] = port V_OUT_[2..1]

### Library data of the parts
C34 = Cap: Multilayer Ceramic Capacitors MLCC - SMD/SMT 50V 0.1uF 0603 X7R 20%; Mfr: KEMET; Mfr Part No: C0603C104M5RACTU; Package: 0603; Price: 0.101; Stockiest: MOUSER; Stockiest Part No: 80-C0603C104M5R; Value: 0.1uF/50V
R26 R28 = Res1: Resistor; Mfr: Vishay / Dale; Mfr Part No: CRCW06031K00FKEAC; Package: 0603; Price: 0.1; Stockiest: MOUSER; Stockiest Part No: 71-CRCW06031K00FKEAC; Value: 1K
R27 R29 = Res1: Thick Film Resistors - SMD 1/10watt 160ohms 1%; Mfr: Vishay / Dale; Mfr Part No: CRCW0603160RFKEA; Package: 0603; Price: 0.1; Stockiest: MOUSER; Stockiest Part No: 71-CRCW0603-160-E3; Value: 160R
U9 = IX4427MTR: Gate Drivers Dual 1.5A Low Side Gate Driver; Mfr: IXYS Integrated Circuits; Mfr Part No: IX4427MTR; Price: 0.97; Stockiest: MOUSER; Stockiest Part No: 849-IX4427MTR